# Altium schematic sheet DSO_Control.SchDoc: Schematic_Name
size A4; CompanyName: University of Melbourne; Engineer: Your Name Here; DocumentNumber: 1; Revision: 0.1; SheetNumber: 1; SheetTotal: 1; Title_Project: Project_Title; StudentNo: Student No.
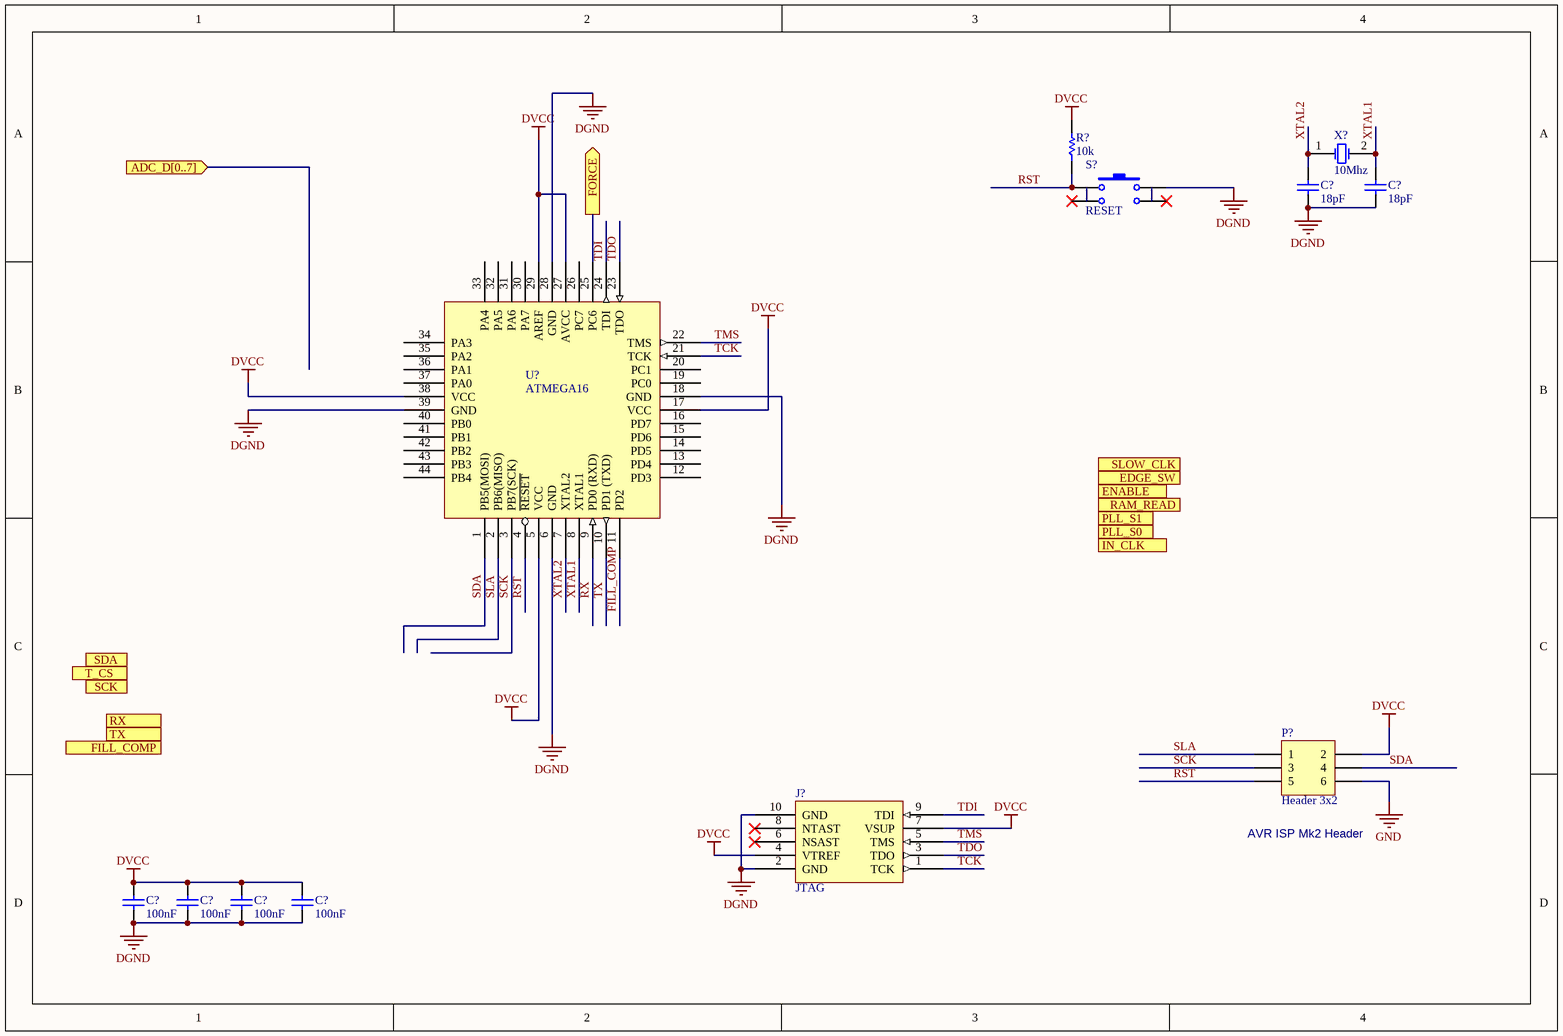
[diagram p0: DSO_Control.SchDoc]

## Parts
(Parts that share a designator on the sheet are numbered #1, #2 ... from top to bottom, then left to right.)
C?#1  18pF  [0805C]
C?#2  18pF  [0805C]
C?#3  100nF  [0805C]
C?#4  100nF  [0805C]
C?#5  100nF  [0805C]
C?#6  100nF  [0805C]
J?  JTAG  [BOXEDVERT10]
P?  Header 3x2  [HDR3x2]
R?  10k  [0805]
S?  RESET  [SPST PB SWITCH SMD]
U?  ATMEGA16  [QFP-48]
X?  10Mhz  [XTAL_FLAT_SMD]

## Ports
ADC_D[0..7] (in), EDGE_SW (out), ENABLE (out), FILL_COMP (in), FORCE (out), IN_CLK (out), PLL_S0 (out), PLL_S1 (out), RAM_READ (out), RX (in), SCK (out), SDA (out), SLOW_CLK (out), T_CS (out), TX (out)

## Nets
DGND: C?#1.2 C?#2.2 C?#3.2 C?#4.2 C?#5.2 C?#6.2 J?.2(GND) J?.10(GND) S?.2 U?.6(GND) U?.18(GND) U?.28(GND) U?.39(GND)
DVCC: C?#3.1 C?#4.1 C?#5.1 C?#6.1 J?.4(VTREF) J?.7(VSUP) P?.2 R?.2 U?.5(VCC) U?.17(VCC) U?.27(AVCC) U?.29(AREF) U?.38(VCC)
GND: P?.6
FILL_COMP: U?.11(PD2)
FORCE: U?.25(PC6) ; port FORCE
RST: P?.5 R?.1 S?.1 U?.4(~{RESET})
RX: U?.9(PD0_(RXD))
SCK: P?.3 U?.3(PB7(SCK))
SDA: P?.4 U?.1(PB5(MOSI))
SLA: P?.1 U?.2(PB6(MISO))
TCK: J?.1(TCK) U?.21(TCK)
TDI: J?.9(TDI) U?.24(TDI)
TDO: J?.3(TDO) U?.23(TDO)
TMS: J?.5(TMS) U?.22(TMS)
TX: U?.10(PD1_(TXD))
XTAL1: C?#2.1 U?.8(XTAL1) X?.2(OSC2)
XTAL2: C?#1.1 U?.7(XTAL2) X?.1(OSC1)

Not connected (* = marked no-connect by the designer): J? 6(NSAST)* 8(NTAST)*; S? 3* 4*; U? 12(PD3) 13(PD4) 14(PD5) 15(PD6) 16(PD7) 19(PC0) 20(PC1) 26(PC7) 30(PA7) 31(PA6) 32(PA5) 33(PA4) 34(PA3) 35(PA2) 36(PA1) 37(PA0) 40(PB0) 41(PB1) 42(PB2) 43(PB3) 44(PB4)

## Notes on the sheet
- (near P?) AVR ISP Mk2 Header

## Library data of the parts
C?#1-C?#6 = C: Capacitor; Reviewed by: RM - 2018/08/05; Revision: July-2002: Re-released for DXP Platform.; Supplier 1: *; Supplier Part Number 1: *
  C?#1 C?#2: Value: 18pF
  C?#3-C?#6: Value: 100nF
J? = JTAG_CON: Reviewed by: RM - 2018/08/05; Supplier 1: Digi-Key; Supplier Part Number 1: OR896-ND
P? = Header 3x2: Header, 5-Pin; Reviewed by: RM - 2018/08/05; Supplier 1: Digi-Key; Supplier Part Number 1: 952-2121-ND
R? = R: Resistor; Reviewed by: RM - 2018/08/05; Value: 10k; Supplier 1: *; Suppler Part Number 1: *
S? = SW_PB_1P1T4: Momentary Push Button Switch 1P 1T 2pins; Reviewed by: RM - 2018/08/05; Revision: July-2002: Re-released for DXP Platform.; Supplier 1: Digi-Key; Supplier Part Number 1: CKN9085CT-ND
U? = ATMEGA16: ATMEGA16 Microcontroller; Reviewed by: RM - 2018/08/05; Supplier 1: Digi-Key; Supplier Part Number 1: ATMEGA16A-AU-ND
X? = XTAL: Crystal Oscillator; Reviewed by: RM - 2018/08/05; Revision: July-2002: Re-released for DXP Platform.; Supplier 1: Digi-Key; Supplier Part Number 1: 887-1080-1-ND